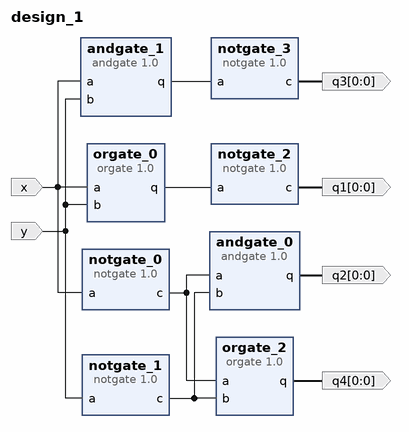
[diagram p0: block diagram of the top level]
# Vivado block design design_1, xc7a100tfgg484-1, Vivado 2017.4
create_bd_design design_1

create_bd_port -dir I x
create_bd_port -dir I y
create_bd_port -dir O -from 0 -to 0 q1
create_bd_port -dir O -from 0 -to 0 q3
create_bd_port -dir O -from 0 -to 0 q4
create_bd_port -dir O -from 0 -to 0 q2

create_bd_cell -type ip -vlnv SUSTC:CSE:orgate:1.0 orgate_0
create_bd_cell -type ip -vlnv SUSTC:CSE:orgate:1.0 orgate_2
create_bd_cell -type ip -vlnv SUSTC:CSE:andgate:1.0 andgate_0
create_bd_cell -type ip -vlnv SUSTC:CSE:notgate:1.0 notgate_0
create_bd_cell -type ip -vlnv SUSTC:CSE:notgate:1.0 notgate_1
create_bd_cell -type ip -vlnv SUSTC:CSE:andgate:1.0 andgate_1
create_bd_cell -type ip -vlnv SUSTC:CSE:notgate:1.0 notgate_2
create_bd_cell -type ip -vlnv SUSTC:CSE:notgate:1.0 notgate_3

# ---- connections ----

connect_bd_net [get_bd_ports x] [get_bd_pins notgate_0/a] [get_bd_pins orgate_0/a] [get_bd_pins andgate_1/a]
connect_bd_net [get_bd_ports y] [get_bd_pins notgate_1/a] [get_bd_pins orgate_0/b] [get_bd_pins andgate_1/b]
connect_bd_net [get_bd_pins andgate_1/q] [get_bd_pins notgate_3/a]
connect_bd_net [get_bd_pins orgate_0/q] [get_bd_pins notgate_2/a]
connect_bd_net [get_bd_pins notgate_0/c] [get_bd_pins orgate_2/a] [get_bd_pins andgate_0/a]
connect_bd_net [get_bd_pins notgate_1/c] [get_bd_pins orgate_2/b] [get_bd_pins andgate_0/b]
connect_bd_net [get_bd_pins notgate_2/c] [get_bd_ports q1]
connect_bd_net [get_bd_pins notgate_3/c] [get_bd_ports q3]
connect_bd_net [get_bd_pins orgate_2/q] [get_bd_ports q4]
connect_bd_net [get_bd_pins andgate_0/q] [get_bd_ports q2]

validate_bd_design
save_bd_design
